# Altium schematic sheet BUCK REGULATOR.SchDoc
size A4; SheetNumber: 4; SheetTotal: 27
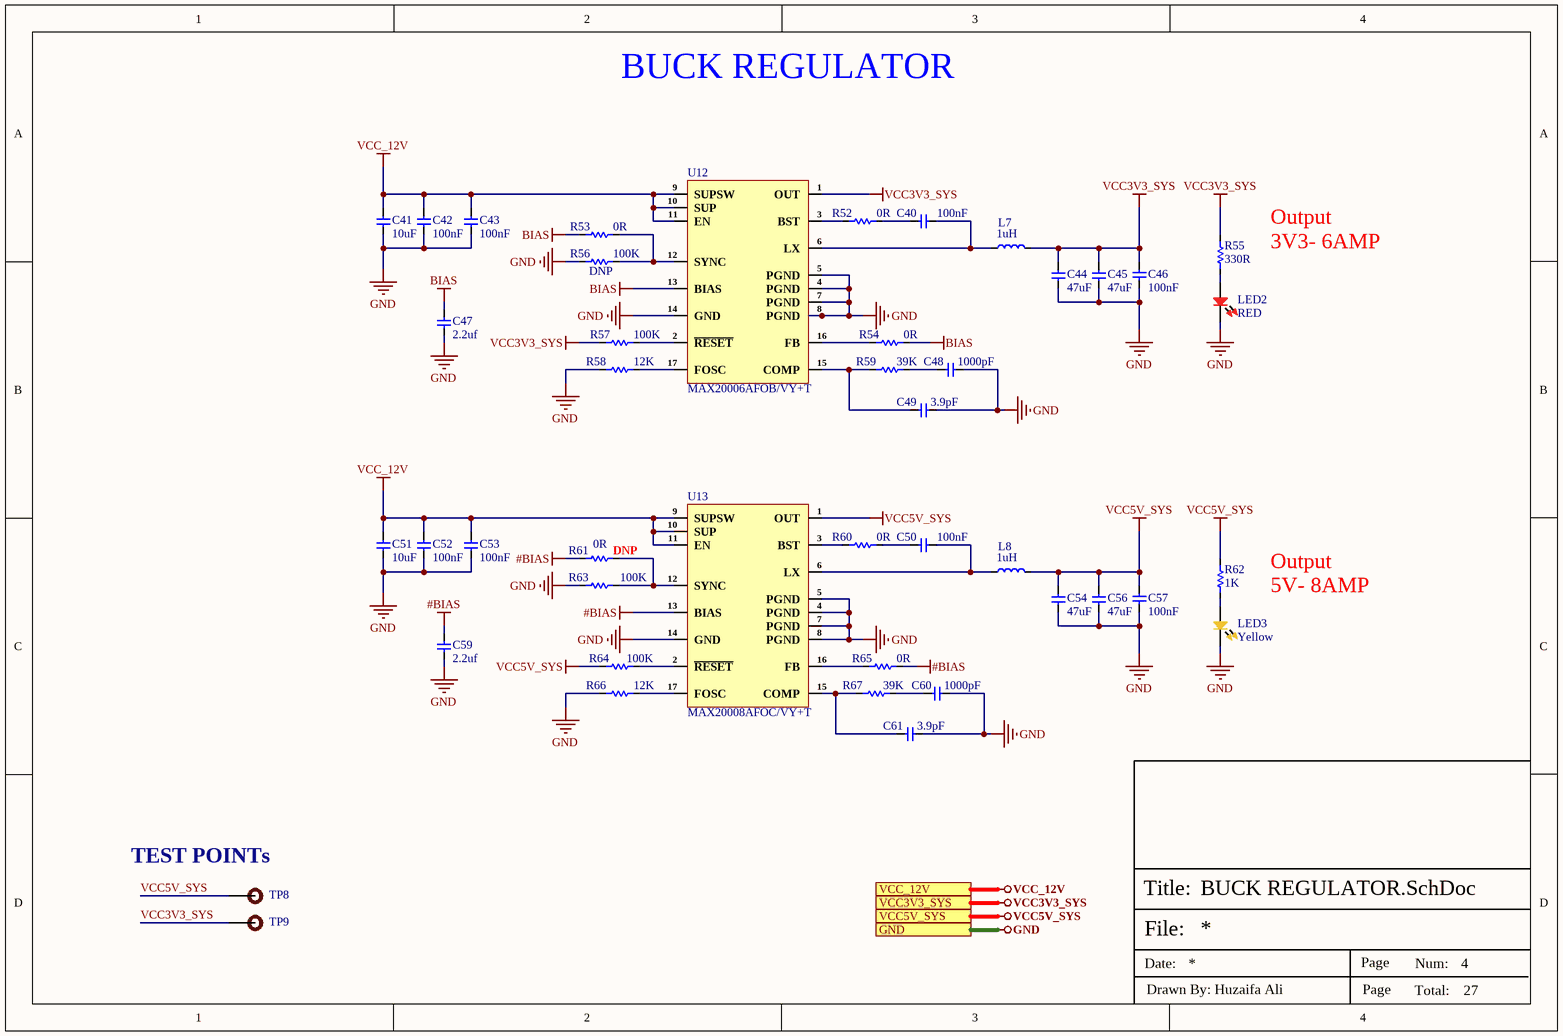
[diagram p0: BUCK REGULATOR.SchDoc]

## Parts
C40  100nF  [cap-0402]
C41  10uF  [Cap-0805]
C42  100nF  [cap-0402]
C43  100nF  [cap-0402]
C44  47uF  [Cap-1206]
C45  47uF  [Cap-1206]
C46  100nF  [cap-0402]
C47  2.2uf  [Cap-0402]
C48  1000pF  [Cap-0402]
C49  3.9pF  [Cap-0402]
C50  100nF  [cap-0402]
C51  10uF  [Cap-0805]
C52  100nF  [cap-0402]
C53  100nF  [cap-0402]
C54  47uF  [Cap-1206]
C56  47uF  [Cap-1206]
C57  100nF  [cap-0402]
C59  2.2uf  [Cap-0402]
C60  1000pF  [Cap-0402]
C61  3.9pF  [Cap-0402]
L7  1uH  [YSPIT0630A-1R0M]
L8  1uH  [YSPIT0630A-1R0M]
LED2  RED  [LED-0603]
LED3  Yellow  [LED-0603]
R52  0R  [Res-0402]
R53  0R  [Res-0402]
R54  0R  [Res-0402]
R55  330R  [Res-0603]
R56  DNP  [Res-0402]
R57  100K  [Res-0402]
R58  12K  [Res-0402]
R59  39K  [Res-0402]
R60  0R  [Res-0402]
R61  DNP  [Res-0402]
R62  1K  [Res-0603]
R63  100K  [Res-0402]
R64  100K  [Res-0402]
R65  0R  [Res-0402]
R66  12K  [Res-0402]
R67  39K  [Res-0402]
TP8  TEST POINT 0.5mm Dia  [Test-point - 0.5mm]  (value not drawn)  (no BOM)
TP9  TEST POINT 0.5mm Dia  [Test-point - 0.5mm]  (value not drawn)  (no BOM)
U12  MAX20006AFOB/VY+T  [17-FC2QFN (3.5x3.75)]
U13  MAX20008AFOC/VY+T  [17-FC2QFN (3.5x3.75)]

## Ports
GND (see POWER SECTION[3B], AUDIO_INTERFACE[1D], DEBUG_UART_INTERFACE[3D], DIGITAL IO_RELAY_SHEET[5D], DUAL_SIM_INTERFACE[3D], ETHERNET_PHY0[4D], ETHERNET_PHY1[4D], GSM_INTERFACE[2D], HDMI_INTERFACE[3D], INPUT_PROTECTION[3D], LINEAR_VOLTAGE_REG[3D], MICRO_SD_INTERFACE[3D], MIPI-DSI DISPLAY[3D], POWER SECTION[3D], PUSH BUTTONs_INTERFACE[3C], RGB_LEDs_INTERFACE[3D], ROCKCHIP_PWR_SUPPLY[1D], ROCKCHIP_SYSTEM_CONTROL[3C], RS232_RS485_INTERFACE[3C], SENSOR_SHEET[3D], USB2.0_INTERFACE[3D], USB3.0_INTERFACE[3D], USB-C_INTERFACE[2D], WIEGAND_INTERFACE[3D], WIFI_BLUETOOTH_SHEET[4C]), VCC3V3_SYS (see POWER SECTION[3B], AUDIO_INTERFACE[1D], DEBUG_UART_INTERFACE[3D], DIGITAL IO_RELAY_SHEET[5D], ETHERNET_PHY0[4D], ETHERNET_PHY1[4D], GSM_INTERFACE[2D], HDMI_INTERFACE[3D], LINEAR_VOLTAGE_REG[3D], MIPI-DSI DISPLAY[3D], POWER SECTION[3D], PUSH BUTTONs_INTERFACE[3C], ROCKCHIP_PWR_SUPPLY[1D], ROCKCHIP_SYSTEM_CONTROL[3C], RS232_RS485_INTERFACE[3C], SENSOR_SHEET[3D], USB-C_INTERFACE[2D], WIEGAND_INTERFACE[3D], WIFI_BLUETOOTH_SHEET[4C]), VCC5V_SYS (see POWER SECTION[3B], DIGITAL IO_RELAY_SHEET[5D], HDMI_INTERFACE[3D], LINEAR_VOLTAGE_REG[3D], MIPI-DSI DISPLAY[3D], POWER SECTION[3D], RGB_LEDs_INTERFACE[3D], ROCKCHIP_PWR_SUPPLY[1D], USB2.0_INTERFACE[3D], USB3.0_INTERFACE[3D], USB-C_INTERFACE[2D], WIEGAND_INTERFACE[3D]), VCC_12V (see POWER SECTION[2B], AUDIO_INTERFACE[1D], INPUT_PROTECTION[3D], POWER SECTION[3D], PUSH BUTTONs_INTERFACE[3C], WIEGAND_INTERFACE[3D])

## Nets
#BIAS: C59.2 R61.1 R65.2 U13.13(BIAS)
BIAS: C47.2 R53.1 R54.2 U12.13(BIAS)
GND: C41.1 C42.1 C43.1 C44.1 C45.1 C46.2 C47.1 C48.1 C49.1 C51.1 C52.1 C53.1 C54.1 C56.1 C57.2 C59.1 C60.1 C61.1 LED2.2 LED3.2 R56.1 R58.1 R63.1 R66.1 U12.4(PGND) U12.5(PGND) U12.7(PGND) U12.8(PGND) U12.14(GND) U13.4(PGND) U13.5(PGND) U13.7(PGND) U13.8(PGND) U13.14(GND) ; port GND
VCC3V3_SYS: C44.2 C45.2 C46.1 L7.2 R55.2 R57.1 TP9.1 U12.1(OUT) ; port VCC3V3_SYS
VCC5V_SYS: C54.2 C56.2 C57.1 L8.2 R62.2 R64.1 TP8.1 U13.1(OUT) ; port VCC5V_SYS
VCC_12V: C41.2 C42.2 C43.2 C51.2 C52.2 C53.2 U12.9(SUPSW) U12.10(SUP) U12.11(EN) U13.9(SUPSW) U13.10(SUP) U13.11(EN) ; port VCC_12V
NetC40_1: C40.1 L7.1 U12.6(LX)
NetC40_2: C40.2 R52.2
NetC48_2: C48.2 R59.1
NetC49_2: C49.2 R59.2 U12.15(COMP)
NetC50_1: C50.1 L8.1 U13.6(LX)
NetC50_2: C50.2 R60.2
NetC60_2: C60.2 R67.1
NetC61_2: C61.2 R67.2 U13.15(COMP)
NetLED2_1: LED2.1 R55.1
NetLED3_1: LED3.1 R62.1
NetR52_1: R52.1 U12.3(BST)
NetR53_2: R53.2 R56.2 U12.12(SYNC)
NetR54_1: R54.1 U12.16(FB)
NetR57_2: R57.2 U12.2(~{RESET})
NetR58_2: R58.2 U12.17(FOSC)
NetR60_1: R60.1 U13.3(BST)
NetR61_2: R61.2 R63.2 U13.12(SYNC)
NetR64_2: R64.2 U13.2(~{RESET})
NetR65_1: R65.1 U13.16(FB)
NetR66_2: R66.2 U13.17(FOSC)

## Notes on the sheet
- BUCK REGULATOR
- 3V3- 6AMP
- (near R55) Output
- (near R56) 100K
- (near R61) 0R
- Output
- 5V- 8AMP
- (near TP8) TEST POINTs
- File:
- Title:
- Date:
- Page
- Num:
- Total:
- Drawn By: Huzaifa Ali

## Library data of the parts
C40 C42 C43 C46 C50 C52 C53 C57 = C1005X7R1H104KT000F: CAP CER 0.1UF 50V X7R 0402; Manufacturer: TDK; Tolerance: 10%; Voltage: 25V; Item Type: Capacitor; Supplier 1: Avnet; Manufacturer Part Number: C1005X7R1H104KT000F; RoHS: No; Category: Ceramic Capacitors; Dielectric: X7R; Supplier Part Number 1: C1005X7R1H104KT000F; LCSC Part Number: C361198; ComponentLink1Description: LCSC; ComponentLink1URL: https://www.lcsc.com/product-detail/Multilayer-Ceramic-Capacitors-MLCC-SMD-SMT_TDK-C1005X7R1H104KT000F_C361198.html
C41 C51 = GRM21BR61H106ME43L: CAP CER 10UF 50V X5R 0805; Manufacturer: Murata; Supplier 1: Digi-Key; Manufacturer Part Number: GRM21BR61H106ME43L; RoHS: Yes; Category: Ceramic Capacitors; Stock 1: 26; Pricing 1: 1=0.44000, 10=0.30700, 50=0.21500, 100=0.18420, 500=0.13818, 1000=0.11668 (USD); Supplier Part Number 1: 490-18664-1-ND; LCSC Part Number: C2190942
C44 C45 C54 C56 = GRM31CR61E476ME44L: CAP CER 47UF 25V X5R 1206; Manufacturer: Murata; Tolerance: 20%; Item Type: Capacitor; Supplier 1: Digi-Key; Manufacturer Part Number: GRM31CR61E476ME44L; RoHS: Yes; Category: Ceramic Capacitors; Capacitance: 47uF; Voltage Rating (DC): 25V; Dielectric: X5R; Length: 3.2mm; Width: 1.6mm; Thickness: 1.6mm; ComponentLink1URL: https://search.murata.co.jp/Ceramy/image/img/A01X/partnumbering_e_01.pdf?src-supplier=Digi-Key; ComponentLink1Description: https://search.murata.co.jp/Ceramy/image/img/A01X/partnumbering_e_01.pdf?src-supplier=Digi-Key; Supplier Part Number 1: 490-16268-2-ND; LCSC Part Number: C403725
C47 C59 = GRM155R61E225KE11D: CAP CER 2.2UF 25V X5R 0402; Manufacturer: Murata; Material: Ceramic; Tolerance: 10%; Item Type: Capacitor; Supplier 1: Avnet; Manufacturer Part Number: GRM155R61E225KE11D; RoHS: Yes; Category: Ceramic Capacitors; Stock 1: 210000; Pricing 1: 10000=0.03830, 20000=0.03623, 40000=0.03416, 60000=0.03209, 80000=0.03002, 100000=0.02795, 1000000=0.02588 (USD); Mount: Surface Mount; Case/Package: 0402; Case Code (Metric): 1005; Case Code (Imperial): 0402; Weight: 0.000212oz; Min Operating Temperature: -55°C; Max Operating Temperature: 85°C; Dielectric: X5R; Capacitance: 2.2uF; Packaging: Tape and Reel; Voltage Rating: 25V; Termination: SMD/SMT; Resistor Type: Ceramic; Voltage Rating (DC): 25V; Package Quantity: 10000; Length: 1mm; Width: 0.5mm; Height: 0.5mm; Thickness: 0.022inch; Lead Free: Lead Free; RoHS Compliant: Yes; ComponentLink1URL: http://www.mouser.com/ds/2/281/c02e-2905.pdf?src-supplier=Mouser; ComponentLink1Description: http://www.mouser.com/ds/2/281/c02e-2905.pdf?src-supplier=Mouser; ComponentLink2URL: http://search.murata.co.jp/Ceramy/image/img/A01X/G101/ENG/GRM155R61E225KE11-01.pdf?src-supplier=Digi-Key; ComponentLink2Description: http://search.murata.co.jp/Ceramy/image/img/A01X/G101/ENG/GRM155R61E225KE11-01.pdf?src-supplier=Digi-Key; ComponentLink3URL: http://search.murata.co.jp/Ceramy/image/img/A01X/partnumbering_e_01.pdf?src-supplier=Digi-Key; ComponentLink3Description: http://search.murata.co.jp/Ceramy/image/img/A01X/partnumbering_e_01.pdf?src-supplier=Digi-Key; ComponentLink4URL: http://psearch.en.murata.com/capacitor/product/GRM155R61E225KE11%23.pdf?src-supplier=Avnet; ComponentLink4Description: http://psearch.en.murata.com/capacitor/product/GRM155R61E225KE11%23.pdf?src-supplier=Avnet; Supplier Part Number 1: GRM155R61E225KE11D; LCSC Part Number: C385032
C48 C60 = CC0402KRX7R8BB102: CAP CER 1000PF 25V X7R 0402; Manufacturer: Yageo; Capacitance: 1nF; Tolerance: 10%; Dissipation Factor: 2.5%; Insulation Resistance: 10GR; Item Type: Capacitor; Supplier 1: Arrow Electronics; Manufacturer Part Number: CC0402KRX7R8BB102; RoHS: Yes; Category: Ceramic Capacitors; Stock 1: 370000; Pricing 1: 1=0.00230, 10000=0.00230, 100001=0.00190 (USD); Mount: Surface Mount; Case/Package: 0402; Number of Pins: 2; Case Code (Imperial): 0402; Case Code (Metric): 1005; Min Operating Temperature: -55°C; Max Operating Temperature: 125°C; Packaging: Tape and Reel; Voltage Rating: 25V; Dielectric: X7R; Termination: SMD/SMT; Voltage Rating (DC): 25V; Series: CC; Length: 1mm; Width: 0.02inch; Thickness: 0.022inch; Depth: 0.5mm; Radiation Hardening: No; Lead Free: Lead Free; Halogen Free: Halogen Free; RoHS Compliant: Yes; ComponentLink1URL: https://datasheet.ciiva.com/26862/getdatasheetpartid-639817-26862638.pdf?src-supplier=Verical; ComponentLink1Description: https://datasheet.ciiva.com/26862/getdatasheetpartid-639817-26862638.pdf?src-supplier=Verical; ComponentLink2URL: https://datasheet.ciiva.com/5425/upy-gp-np0-16v-to-50v-8-3714-5425527.pdf?src-supplier=Mouser; ComponentLink2Description: https://datasheet.ciiva.com/5425/upy-gp-np0-16v-to-50v-8-3714-5425527.pdf?src-supplier=Mouser; Supplier Part Number 1: CC0402KRX7R8BB102; LCSC Part Number: C541372
C49 C61 = CC0402BRNPO9BN3R9: CAP CER 3.9PF 50V C0G/NPO 0402; Manufacturer: Yageo; Item Type: Capacitor; Supplier: Future Electronics; Supplier Part Number: 4917324; Manufacturer Part Number: CC0402BRNPO9BN3R9; RoHS: Yes; Category: Ceramic Capacitors; Stock: 280000; Pricing: 10000=0.0034, 40000=0.0032, 150000=0.0031, 250000=0.003, 500000=0.0028 (USD); ComponentLink1URL: https://datasheet.ciiva.com/11587/upy-gp-np0-16v-to-50v-8-11587133.pdf?src-supplier=Avnet; ComponentLink1Description: https://datasheet.ciiva.com/11587/upy-gp-np0-16v-to-50v-8-11587133.pdf?src-supplier=Avnet; ComponentLink2URL: https://datasheet.ciiva.com/13211/upy-gp-np0-16v-to-50v-8-13211126.pdf?src-supplier=Mouser; ComponentLink2Description: https://datasheet.ciiva.com/13211/upy-gp-np0-16v-to-50v-8-13211126.pdf?src-supplier=Mouser; LCSC Part Number: C505474
L7 L8 = YSPIT0630A-1R0M: 1uH ±20% 23A SMD,6.6x6.4mm Power Inductors ROHS; Manufacturer: YJYCOIN; Manufacturer Part Number: YSPIT0630A-1R0M; ComponentLink1URL: https://www.lcsc.com/product-detail/Power-Inductors_YJYCOIN-YSPIT0630A-1R0M_C18236293.html; ComponentLink1Description: LCSC; Item Type: Inductor; Package: SMD,6.6x6.4mm; LCSC Part Number: C18236293
LED2 = NCD0603R3: RED LED 0603 Light Emitting Diodes; Manufacturer: Foshan NationStar Optoelectronics; Manufacturer Part Number: NCD0603R3; Package: 0603; Item Type: LED; LCSC Part Number: C3151730; ComponentLink1Description: LCSC; ComponentLink1URL: https://www.lcsc.com/product-detail/Light-Emitting-Diodes-LED_Foshan-NationStar-Optoelectronics-NCD0603R3_C3151730.html
LED3 = NCD0603Y2: yellow 0603 Light Emitting Diodes (LED) ROHS; Manufacturer: Foshan NationStar Optoelectronics; Manufacturer Part Number: NCD0603Y2; Package: 0603; LCSC Part Number: C89811; Item Type: LED; ComponentLink1Description: LCSC; ComponentLink1URL: https://www.lcsc.com/product-detail/Light-Emitting-Diodes-LED_Foshan-NationStar-Optoelectronics-NCD0603Y2_C89811.html
R52-R54 R60 R65 = RC0402FR-070RL: RES 0 OHM JUMPER 1/16W 0402; Manufacturer: Yageo; Tolerance: 1%; Power Rating: 62.5mW; Voltage Rating: 50V; Temperature Coefficient: 200ppm/°C; Max Power Dissipation: 63mW; Supplier 1: Mouser; Manufacturer Part Number: RC0402FR-070RL; RoHS: Yes; Category: Chip SMD Resistors; Stock 1: 8556842; Pricing 1: 1=0.10000, 10=0.01400, 50=0.01400, 100=0.00600, 1000=0.00300, 5000=0.00200, 10000=0.00100 (USD); Mount: Surface Mount; Case/Package: 0402; Contact Plating: Tin,Matte; Case Code (Imperial): 0402; Case Code (Metric): 1005; Size Code: 0402; Min Operating Temperature: -55°C; Max Operating Temperature: 155°C; Resistance: 0R; Resistor Type: Thick Film; Packaging: Tape and Reel; Termination: SMD/SMT; Features: Moisture Resistant; Series: RC; Number of Terminations: 2; Length: 1mm; Width: 0.5mm; Height: 0.35mm; Radiation Hardening: No; Lead Free: Lead Free; RoHS Compliant: Yes; ComponentLink1URL: https://datasheet.ciiva.com/8896/pyu-rc0402-51-rohs-l-6-8896149.pdf?src-supplier=Avnet; ComponentLink1Description: https://datasheet.ciiva.com/8896/pyu-rc0402-51-rohs-l-6-8896149.pdf?src-supplier=Avnet; ComponentLink2URL: https://datasheet.ciiva.com/16790/pyu-rc0402-51-rohs-l-6-r-16790444.pdf?src-supplier=Future+Electronics; ComponentLink2Description: https://datasheet.ciiva.com/16790/pyu-rc0402-51-rohs-l-6-r-16790444.pdf?src-supplier=Future+Electronics; Supplier Part Number 1: 603-RC0402FR-070RL; LCSC Part Number: C106231
R55 = RC0603JR-07330RL: RES  SMD 330R 100 mW 0603; Manufacturer: Yageo; Power Rating: 100mW; Tolerance: 5%; Voltage Rating (DC): 50V; Temperature Coefficient: 100ppm/°C; Item Type: Resistor; Supplier 1: Digi-Key; Manufacturer Part Number: RC0603JR-07330RL; RoHS: Yes; Category: Chip SMD Resistors; Stock 1: 1074593; Pricing 1: 1=0.10000, 10=0.02000, 100=0.00800, 1000=0.00360, 2500=0.00312 (USD); Case/Package: 0603; Number of Pins: 2; Case Code (Imperial): 0603; Case Code (Metric): 1608; Size Code: 0603; Min Operating Temperature: -55°C; Max Operating Temperature: 155°C; Resistance: 330R; Packaging: Tape and Reel; Voltage Rating: 50V; Package Quantity: 5000; Termination: SMD/SMT; Resistor Type: Thick Film; Features: Moisture Resistant; Series: RC; Max Power Dissipation: 100mW; Number of Terminations: 2; Resistance Tolerance: 5%; Construction: Rectangular; Length: 1.6mm; Width: 0.8mm; Height: 0.45mm; Depth: 0.8mm; REACH SVHC: No SVHC; Lead Free: Lead Free; Military Standard: Not; RoHS Compliant: Yes; Supplier Part Number 1: 311-330GRCT-ND; LCSC Part Number: C105879
R56 R57 R63 R64 = RC0402FR-07100KL: RES 100K OHM 1% 1/16W 0402; Manufacturer: Yageo; Resistance: 100kR; Temperature Coefficient: 100ppm/°C; Power Rating: 63mW; Voltage Rating: 50V; Item Type: Resistor; Supplier 1: Mouser; Manufacturer Part Number: RC0402FR-07100KL; RoHS: Yes; Category: Chip SMD Resistors; Stock 1: 7759549; Pricing 1: 1=0.10000, 10=0.01200, 50=0.01200, 100=0.00500, 1000=0.00300, 2500=0.00200, 10000=0.00100 (USD); Case/Package: 0402; Case Code (Metric): 1005; Case Code (Imperial): 0402; Min Operating Temperature: -55°C; Max Operating Temperature: 155°C; Resistor Type: Thick Film; Tolerance: 1%; Packaging: Tape and Reel; Package Quantity: 1; Number of Terminations: 2; Termination: SMD/SMT; Max Power Dissipation: 63mW; Working Voltage: 50V; Features: Moisture Resistant; Series: RC; Resistance Tolerance: 1%; Construction: Rectangular; Technology: THICK FILM; Length: 0.039inch; Width: 0.02inch; Height: 0.016inch; Depth: 0.5mm; REACH SVHC: No SVHC; Lead Free: Lead Free; RoHS Compliant: Yes; Military Standard: Not; ComponentLink1URL: https://datasheet.ciiva.com/11819/0900766b80c66297-11819452.pdf?src-supplier=RSComponents; ComponentLink1Description: https://datasheet.ciiva.com/11819/0900766b80c66297-11819452.pdf?src-supplier=RSComponents; ComponentLink2URL: https://datasheet.ciiva.com/22747/1018594-22747509.pdf?src-supplier=Element14; ComponentLink2Description: https://datasheet.ciiva.com/22747/1018594-22747509.pdf?src-supplier=Element14; ComponentLink3URL: https://datasheet.ciiva.com/2453/pyu-r-int-thick-7-2453362.pdf?src-supplier=Digi-Key; ComponentLink3Description: https://datasheet.ciiva.com/2453/pyu-r-int-thick-7-2453362.pdf?src-supplier=Digi-Key; ComponentLink4URL: https://datasheet.ciiva.com/2453/pyu-r-int-thick-7-2453363.pdf?src-supplier=Digi-Key; ComponentLink4Description: https://datasheet.ciiva.com/2453/pyu-r-int-thick-7-2453363.pdf?src-supplier=Digi-Key; ComponentLink5URL: https://datasheet.ciiva.com/2453/pyu-r-int-thick-7-2453361.pdf?src-supplier=Digi-Key; ComponentLink5Description: https://datasheet.ciiva.com/2453/pyu-r-int-thick-7-2453361.pdf?src-supplier=Digi-Key; ComponentLink6URL: https://datasheet.ciiva.com/12667/pyu-rc0402-51-rohs-l-6-r-12667930.pdf?src-supplier=Mouser; ComponentLink6Description: https://datasheet.ciiva.com/12667/pyu-rc0402-51-rohs-l-6-r-12667930.pdf?src-supplier=Mouser; ComponentLink7URL: https://datasheet.ciiva.com/15189/getdatasheetpartid-323696-15189334.pdf?src-supplier=Verical; ComponentLink7Description: https://datasheet.ciiva.com/15189/getdatasheetpartid-323696-15189334.pdf?src-supplier=Verical; Supplier Part Number 1: 603-RC0402FR-07100KL; LCSC Part Number: C60491
R58 R66 = RC0402FR-0712KL: RES 12K OHM 1% 1/16W 0402; Manufacturer: Yageo; Temperature Coefficient: 100ppm/°C; Max Power Dissipation: 63mW; Value: 12kR; Power Rating: 62.5mW; Voltage Rating: 50V; Manufacturer Part Number: RC0402FR-0712KL; Case/Package: 0402; Min Operating Temperature: -55°C; Max Operating Temperature: 155°C; Tolerance: 1%; Packaging: Tape and Reel; Resistor Type: Thick Film; Number of Terminations: 2; Features: Moisture Resistant; Length: 1mm; Width: 0.02inch; ComponentLink1URL: https://datasheet.ciiva.com/46412/1018594-46412831.pdf?src-supplier=Element14; ComponentLink1Description: https://datasheet.ciiva.com/46412/1018594-46412831.pdf?src-supplier=Element14; ComponentLink2URL: https://datasheet.ciiva.com/2453/pyu-r-int-thick-7-2453380.pdf?src-supplier=Digikey; ComponentLink2Description: https://datasheet.ciiva.com/2453/pyu-r-int-thick-7-2453380.pdf?src-supplier=Digikey; ComponentLink3URL: https://datasheet.ciiva.com/2453/pyu-r-int-thick-7-2453381.pdf?src-supplier=Digikey; ComponentLink3Description: https://datasheet.ciiva.com/2453/pyu-r-int-thick-7-2453381.pdf?src-supplier=Digikey; Package Quantity: 1; Height: 0.016inch; Supplier: Future Electronics; Supplier Part Number: 5655139; RoHS: Yes; Category: Chip SMD Resistors; Stock: 2030000; Pricing: 10000=0.0011, 100000=0.0011, 300000=0.001, 750000=0.001, 2000000=0.0009 (USD); Case Code (Metric): 1005; Case Code (Imperial): 0402; Weight: 2.3E-05oz; Termination: SMD/SMT; Series: RC; Resistance Tolerance: 1%; Construction: Rectangular; Voltage Rating (AC): 50V; Depth: 0.5mm; Reach SVHC Compliant: No; Military Standard: Not; RoHS Compliant: Yes; Lead Free: 5697LeadFree; ComponentLink4URL: https://datasheet.ciiva.com/2453/pyu-r-int-thick-7-2453379.pdf?src-supplier=Digikey; ComponentLink4Description: https://datasheet.ciiva.com/2453/pyu-r-int-thick-7-2453379.pdf?src-supplier=Digikey; ComponentLink5URL: https://datasheet.ciiva.com/12577/pyu-rc0402-51-rohs-l-6-r-12577269.pdf?src-supplier=Mouser; ComponentLink5Description: https://datasheet.ciiva.com/12577/pyu-rc0402-51-rohs-l-6-r-12577269.pdf?src-supplier=Mouser; ComponentLink6URL: https://datasheet.ciiva.com/7849/1018594-7849833.pdf?src-supplier=Element14; ComponentLink6Description: https://datasheet.ciiva.com/7849/1018594-7849833.pdf?src-supplier=Element14; ComponentLink7URL: https://datasheet.ciiva.com/7849/1018594-7849832.pdf?src-supplier=Element14; ComponentLink7Description: https://datasheet.ciiva.com/7849/1018594-7849832.pdf?src-supplier=Element14; ComponentLink8URL: https://datasheet.ciiva.com/16744/pyu-rc0402-51-rohs-l-6-r-16744492.pdf?src-supplier=Future+Electronics; ComponentLink8Description: https://datasheet.ciiva.com/16744/pyu-rc0402-51-rohs-l-6-r-16744492.pdf?src-supplier=Future+Electronics
R59 R67 = RC0402FR-0739KL: RES 39K OHM 1% 1/16W 0402; Manufacturer: Yageo; Voltage Rating: 50V; Resistance: 39kR; Power Rating: 63mW; Temperature Coefficient: 100ppm/°C; Supplier 1: Mouser; Manufacturer Part Number: RC0402FR-0739KL; RoHS: Yes; Category: Chip SMD Resistors; Stock 1: 177055; Pricing 1: 1=0.10000, 10=0.01200, 50=0.01200, 100=0.00500, 1000=0.00300, 2500=0.00200, 10000=0.00100 (USD); Case/Package: 0402; Case Code (Metric): 1005; Case Code (Imperial): 0402; Size Code: 0402; Min Operating Temperature: -55°C; Max Operating Temperature: 155°C; Packaging: Tape and Reel; Tolerance: 1%; Package Quantity: 1; Resistor Type: Thick Film; Number of Terminations: 2; Termination: SMD/SMT; Max Power Dissipation: 63mW; Features: Moisture Resistant; Series: RC; Resistance Tolerance: 1%; Construction: Rectangular; Technology: THICK FILM; Length: 1mm; Width: 0.02inch; Height: 0.016inch; Depth: 0.5mm; RoHS Compliant: Yes; REACH SVHC: Unknown; Military Standard: Not; Lead Free: Lead Free; ComponentLink1URL: https://datasheet.ciiva.com/11819/0900766b80c66297-11819480.pdf?src-supplier=RSComponents; ComponentLink1Description: https://datasheet.ciiva.com/11819/0900766b80c66297-11819480.pdf?src-supplier=RSComponents; ComponentLink2URL: https://datasheet.ciiva.com/2553/pyu-r-int-thick-7-2553207.pdf?src-supplier=Digi-Key; ComponentLink2Description: https://datasheet.ciiva.com/2553/pyu-r-int-thick-7-2553207.pdf?src-supplier=Digi-Key; ComponentLink3URL: https://datasheet.ciiva.com/2553/pyu-r-int-thick-7-2553208.pdf?src-supplier=Digi-Key; ComponentLink3Description: https://datasheet.ciiva.com/2553/pyu-r-int-thick-7-2553208.pdf?src-supplier=Digi-Key; ComponentLink4URL: https://datasheet.ciiva.com/2553/pyu-r-int-thick-7-2553206.pdf?src-supplier=Digi-Key; ComponentLink4Description: https://datasheet.ciiva.com/2553/pyu-r-int-thick-7-2553206.pdf?src-supplier=Digi-Key; ComponentLink5URL: https://datasheet.ciiva.com/12668/pyu-rc0402-51-rohs-l-6-r-12668186.pdf?src-supplier=Mouser; ComponentLink5Description: https://datasheet.ciiva.com/12668/pyu-rc0402-51-rohs-l-6-r-12668186.pdf?src-supplier=Mouser; ComponentLink6URL: https://datasheet.ciiva.com/7849/1018594-7849980.pdf?src-supplier=Element14; ComponentLink6Description: https://datasheet.ciiva.com/7849/1018594-7849980.pdf?src-supplier=Element14; ComponentLink7URL: https://datasheet.ciiva.com/7849/1018594-7849981.pdf?src-supplier=Element14; ComponentLink7Description: https://datasheet.ciiva.com/7849/1018594-7849981.pdf?src-supplier=Element14; ComponentLink8URL: https://datasheet.ciiva.com/16941/pyu-rc0402-51-rohs-l-6-r-16941400.pdf?src-supplier=Future+Electronics; ComponentLink8Description: https://datasheet.ciiva.com/16941/pyu-rc0402-51-rohs-l-6-r-16941400.pdf?src-supplier=Future+Electronics; Supplier Part Number 1: 603-RC0402FR-0739KL; LCSC Part Number: C137995
R61 = RC0402FR-070RL: RES 0 OHM JUMPER 1/16W 0402; Manufacturer: Yageo; Resistance: 0R; Tolerance: 1%; Power Rating: 62.5mW; Voltage Rating: 50V; Temperature Coefficient: 200ppm/°C; Max Power Dissipation: 63mW; Supplier 1: Mouser; Manufacturer Part Number: RC0402FR-070RL; RoHS: Yes; Category: Chip SMD Resistors; Stock 1: 8556842; Pricing 1: 1=0.10000, 10=0.01400, 50=0.01400, 100=0.00600, 1000=0.00300, 5000=0.00200, 10000=0.00100 (USD); Mount: Surface Mount; Case/Package: 0402; Contact Plating: Tin,Matte; Case Code (Imperial): 0402; Case Code (Metric): 1005; Size Code: 0402; Min Operating Temperature: -55°C; Max Operating Temperature: 155°C; Resistor Type: Thick Film; Packaging: Tape and Reel; Termination: SMD/SMT; Features: Moisture Resistant; Series: RC; Number of Terminations: 2; Length: 1mm; Width: 0.5mm; Height: 0.35mm; Radiation Hardening: No; Lead Free: Lead Free; RoHS Compliant: Yes; ComponentLink1URL: https://datasheet.ciiva.com/8896/pyu-rc0402-51-rohs-l-6-8896149.pdf?src-supplier=Avnet; ComponentLink1Description: https://datasheet.ciiva.com/8896/pyu-rc0402-51-rohs-l-6-8896149.pdf?src-supplier=Avnet; ComponentLink2URL: https://datasheet.ciiva.com/16790/pyu-rc0402-51-rohs-l-6-r-16790444.pdf?src-supplier=Future+Electronics; ComponentLink2Description: https://datasheet.ciiva.com/16790/pyu-rc0402-51-rohs-l-6-r-16790444.pdf?src-supplier=Future+Electronics; Supplier Part Number 1: 603-RC0402FR-070RL; LCSC Part Number: C106231
R62 = CRCW06031K00FKEA: RES SMD 1K OHM 1% 1/10W 0603; Manufacturer: Vishay Dale; Item Type: Resistor; Value: 1kR; Voltage Rating: 75V; Temperature Coefficient: 100ppm/°C; Power Rating: 100mW; LCSC Part Number: C844920; ComponentLink2URL: https://datasheet.ciiva.com/11808/0900766b80d98afc-11808625.pdf?src-supplier=Rs; ComponentLink2Description: https://datasheet.ciiva.com/11808/0900766b80d98afc-11808625.pdf?src-supplier=Rs; ComponentLink3URL: https://datasheet.ciiva.com/46441/1720486-46441623.pdf?src-supplier=Element14; ComponentLink3Description: https://datasheet.ciiva.com/46441/1720486-46441623.pdf?src-supplier=Element14; ComponentLink4URL: https://datasheet.ciiva.com/46441/1720486-46441622.pdf?src-supplier=Element14; ComponentLink4Description: https://datasheet.ciiva.com/46441/1720486-46441622.pdf?src-supplier=Element14; ComponentLink5URL: https://datasheet.ciiva.com/26316/fld-crcw-e3-data-en-26316551.pdf?src-supplier=Distrelec; ComponentLink5Description: https://datasheet.ciiva.com/26316/fld-crcw-e3-data-en-26316551.pdf?src-supplier=Distrelec; ComponentLink6URL: https://datasheet.ciiva.com/2465/dcrcwe3-2465536.pdf?src-supplier=Digi-Key; ComponentLink6Description: https://datasheet.ciiva.com/2465/dcrcwe3-2465536.pdf?src-supplier=Digi-Key; ComponentLink7URL: https://datasheet.ciiva.com/2465/dcrcwe3-2465534.pdf?src-supplier=Digi-Key; ComponentLink7Description: https://datasheet.ciiva.com/2465/dcrcwe3-2465534.pdf?src-supplier=Digi-Key; ComponentLink8URL: https://datasheet.ciiva.com/16199/dcrcwe3-16199053.pdf?src-supplier=Future+Electronics; ComponentLink8Description: https://datasheet.ciiva.com/16199/dcrcwe3-16199053.pdf?src-supplier=Future+Electronics; ComponentLink9URL: https://datasheet.ciiva.com/46385/1697337-46385497.pdf?src-supplier=Element14; ComponentLink9Description: https://datasheet.ciiva.com/46385/1697337-46385497.pdf?src-supplier=Element14; ComponentLink10URL: https://datasheet.ciiva.com/2465/dcrcwe3-2465535.pdf?src-supplier=Digi-Key; ComponentLink10Description: https://datasheet.ciiva.com/2465/dcrcwe3-2465535.pdf?src-supplier=Digi-Key; ComponentLink11URL: https://datasheet.ciiva.com/8336/dcrcwe3-8336822.pdf?src-supplier=Avnet; ComponentLink11Description: https://datasheet.ciiva.com/8336/dcrcwe3-8336822.pdf?src-supplier=Avnet; ComponentLink12URL: https://datasheet.ciiva.com/3257/dcrcwe3-3257132.pdf?src-supplier=Avnet; ComponentLink12Description: https://datasheet.ciiva.com/3257/dcrcwe3-3257132.pdf?src-supplier=Avnet; Supplier: Mouser; Supplier Part Number: 71-CRCW0603-1.0K-E3; Manufacturer Part Number: CRCW06031K00FKEA; RoHS: Yes; Category: Chip SMD Resistors; Stock: 1295653; Pricing: 1=0.1, 10=0.017, 50=0.017, 100=0.01, 1000=0.008, 10000=0.004 (USD); Case/Package: 0603; Pins: 2; Contact Plating: Tin; Weight: 7.1E-05oz; Case Code (Metric): 1608; Case Code (Imperial): 0603; Min Operating Temperature: -55°C; Max Operating Temperature: 155°C; Tolerance: 1%; Resistor Type: Thick Film; Packaging: Tape and Reel; Package Quantity: 5000; Number of Terminations: 2; Termination: SMD/SMT; Max Power Dissipation: 100mW; Features: Automotive AEC-Q200; Series: CRCW; Technology: THICK FILM; Resistance Tolerance: 1%; Voltage Rating (DC): 75V; Construction: Rectangular; Length: 1.55mm; Width: 0.85mm; Height: 0.45mm; Depth: 0.85mm; Ratings: AEC-Q200; Radiation Hardening: No; RoHS Compliant: Yes; Reach SVHC Compliant: Unknown; Lead Free: 5697LeadFree; Military Standard: Not; ComponentLink1URL: https://datasheet.ciiva.com/11808/0900766b80d98afc-11808625.pdf?src-supplier=Rs; ComponentLink1Description: https://datasheet.ciiva.com/11808/0900766b80d98afc-11808625.pdf?src-supplier=Rs; ComponentLink13URL: https://datasheet.ciiva.com/2465/dcrcwe3-2465535.pdf?src-supplier=Digikey; ComponentLink13Description: https://datasheet.ciiva.com/2465/dcrcwe3-2465535.pdf?src-supplier=Digikey; ComponentLink14URL: https://datasheet.ciiva.com/2465/dcrcwe3-2465536.pdf?src-supplier=Digikey; ComponentLink14Description: https://datasheet.ciiva.com/2465/dcrcwe3-2465536.pdf?src-supplier=Digikey; ComponentLink15URL: https://datasheet.ciiva.com/2465/dcrcwe3-2465534.pdf?src-supplier=Digikey; ComponentLink15Description: https://datasheet.ciiva.com/2465/dcrcwe3-2465534.pdf?src-supplier=Digikey
TP8 TP9 = TEST POINT 0.5mm Dia: Test Point ON; Item Type: Test Point; Manufacturer Part Number: TEST POINT 0.5mm Dia
U12 = MAX20006AFOB/VY+T: IC REG BUCK 3.3V 6A 17FC2QFN; Manufacturer: Maxim; Supplier: DigiKey; Supplier Part Number: 505-MAX20006AFOB/VY+TTR-ND; Manufacturer Part Number: MAX20006AFOB/VY+T; RoHS: Yes; Category: Voltage Regulators - Switching; Pricing: 2500=2.5254 (USD); Item Type: IC
U13 = MAX20008AFOC/VY+T: IC REG BUCK 5V 8A 17FC2QFN; Manufacturer: Analog Devices; Supplier: Mouser; Supplier Part Number: 700-MAX20008AFOC/VYT; Manufacturer Part Number: MAX20008AFOC/VY+T; RoHS: No; Category: Voltage Regulators - Switching; Stock: 4724; Pricing: 1=5.69, 10=5, 50=5, 100=4.18, 1000=3.19, 10000=3.19 (USD); Item Type: IC